# EAGLE design matrixdriver (EAGLE 7.0.0)
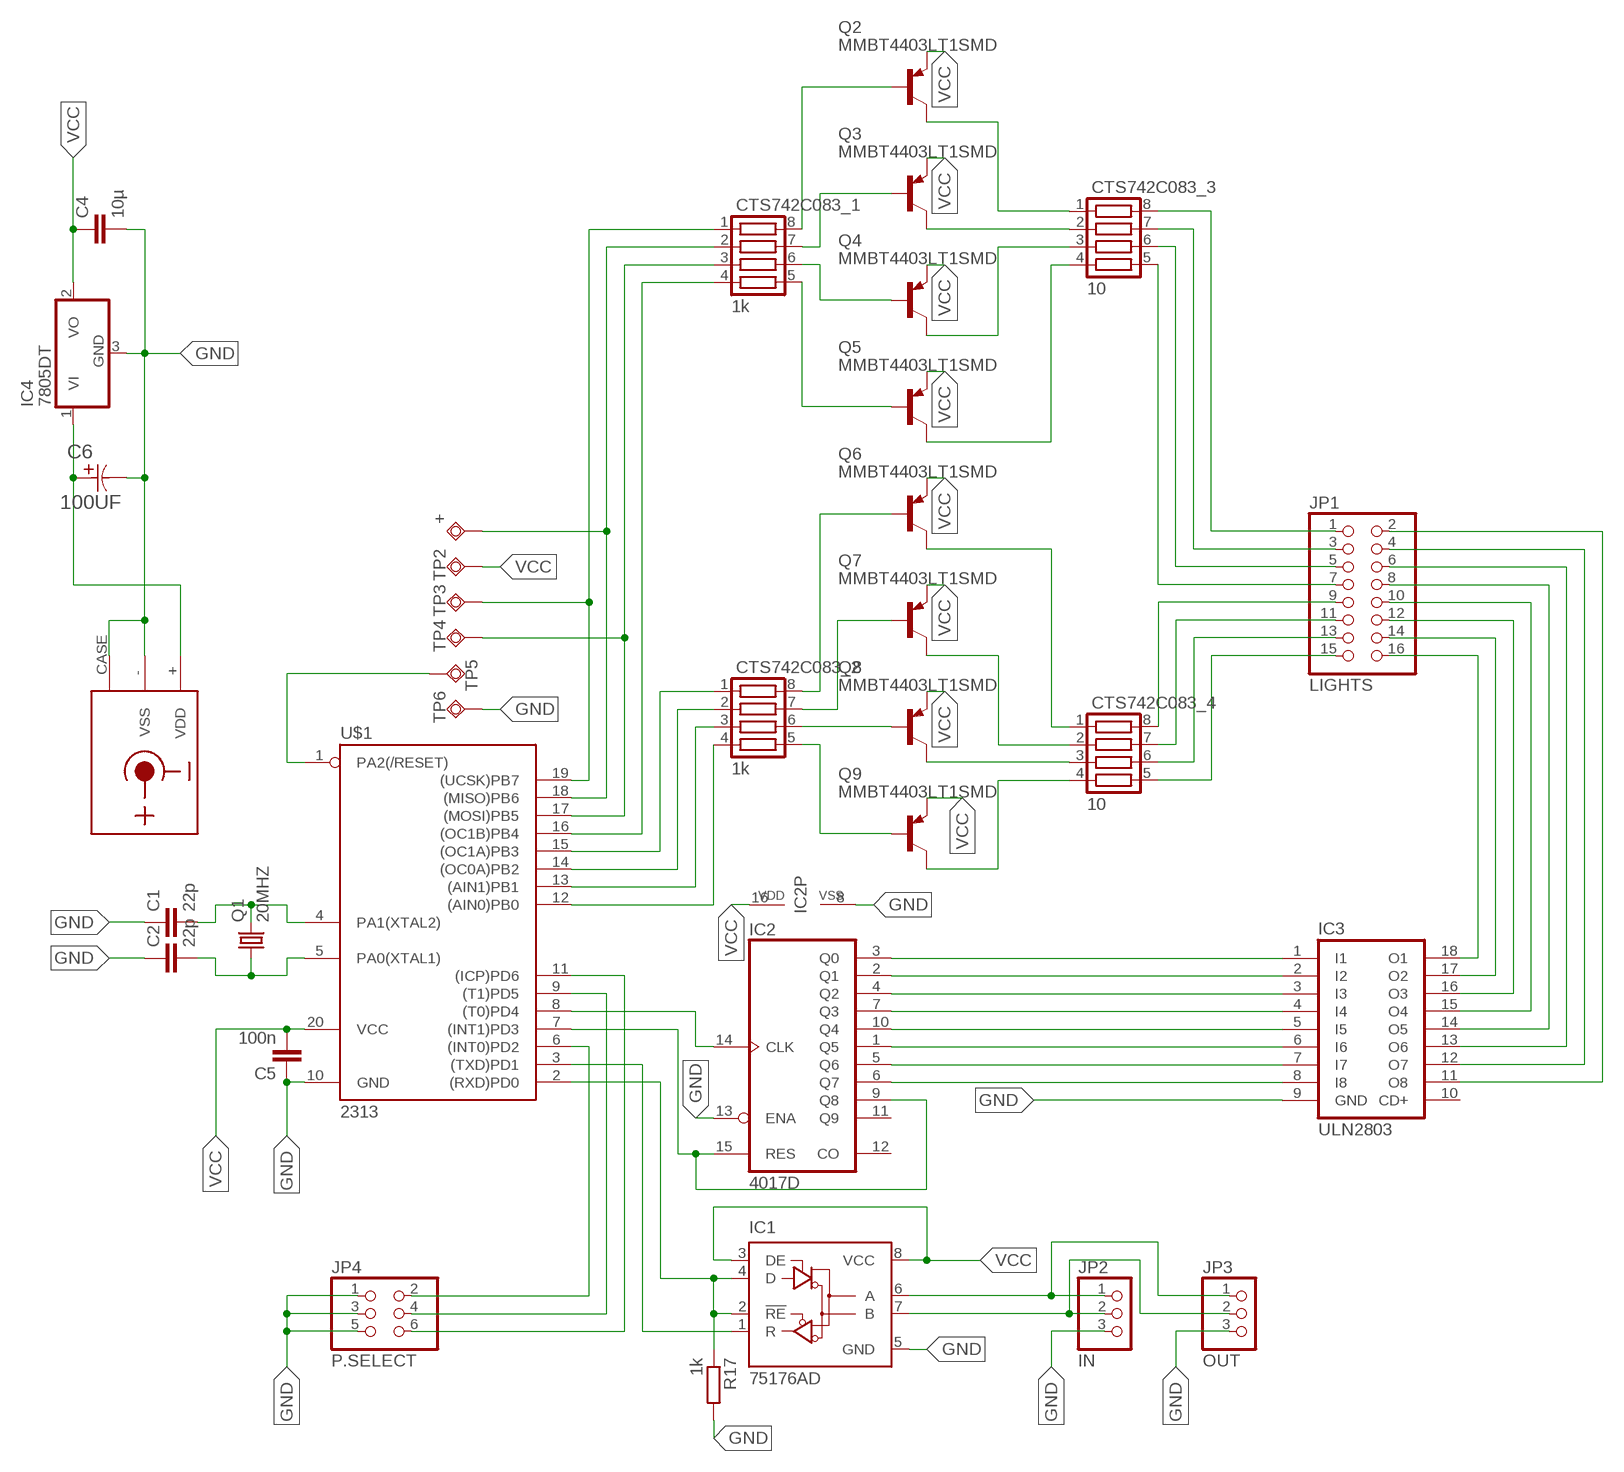
[diagram p0: schematic, sheet 1]

## Parts
+  TPSQTP20R  [TP20R]
C1  22p  C-EUC1206  [C1206]
C2  22p  C-EUC1206  [C1206]
C4  10µ  C-EUC1206  [C1206]
C5  100n  C-EUC1206  [C1206]
C6  100UF  EEE-HC1C101XP-CASE-D8  [CAPAE660X800N]
CTS742C083_1  1k  CTS742C083  [CTS742C083]
CTS742C083_2  1k  CTS742C083  [CTS742C083]
CTS742C083_3  10  CTS742C083  [CTS742C083]
CTS742C083_4  10  CTS742C083  [CTS742C083]
IC1  75176AD  [D_R-PDSO-G8]
IC2  4017D  [SO16]
IC3  ULN2803  ULN2803ASMD  [SO18W]
IC4  7805DT  [TO252]
JP1  LIGHTS  PINHD-2X8_2.54  [2X08]
JP2  IN  PINHD-1X3  [1X03]
JP3  OUT  PINHD-1X3  [1X03]
JP4  P.SELECT  PINHD-2X3  [2X03]
Q1  20MHZ  CRYSTALHC49UP  [HC49UP]
Q2  MMBT4403LT1SMD  [SOT23-BEC]
Q3  MMBT4403LT1SMD  [SOT23-BEC]
Q4  MMBT4403LT1SMD  [SOT23-BEC]
Q5  MMBT4403LT1SMD  [SOT23-BEC]
Q6  MMBT4403LT1SMD  [SOT23-BEC]
Q7  MMBT4403LT1SMD  [SOT23-BEC]
Q8  MMBT4403LT1SMD  [SOT23-BEC]
Q9  MMBT4403LT1SMD  [SOT23-BEC]
R17  1k  R-EU_R1206  [R1206]
TP2  TPSQTP19SQ  [TP19SQ]
TP3  TPSQTP20SQ  [TP20SQ]
TP4  TPSQTP20SQ  [TP20SQ]
TP5  TPSQTP20SQ  [TP20SQ]
TP6  TPSQTP20SQ  [TP20SQ]
U$1  2313  TINY2313-*S*  [SO20L$]
U$2  CUI_PJ-102A  [CUI_DCJACK_PCB]

## Nets
GND [GND]: C1.1 C2.1 C4.2 C5.1 C6.2 IC1.5(GND) IC2.8(VSS) IC2.13(ENA) IC3.9(GND) IC4.3(GND) JP2.3 JP3.3 JP4.1 JP4.3 JP4.5 R17.2 TP6.TP U$1.10(GND) U$2.-(VSS) U$2.CASE
N$1: CTS742C083_2.4 U$1.12((AIN0)PB0)
N$2: CTS742C083_2.3 U$1.13((AIN1)PB1)
N$3: CTS742C083_2.2 U$1.14((OC0A)PB2)
N$4: CTS742C083_2.1 U$1.15((OC1A)PB3)
N$5: CTS742C083_1.4 U$1.16((OC1B)PB4)
N$6: CTS742C083_1.3 TP4.TP U$1.17((MOSI)PB5)
N$7: +.TP CTS742C083_1.2 U$1.18((MISO)PB6)
N$8: CTS742C083_1.1 TP3.TP U$1.19((UCSK)PB7)
N$9: IC1.1(R) U$1.3((TXD)PD1)
N$10: IC1.2(!RE) IC1.4(D) R17.1 U$1.2((RXD)PD0)
N$11: C1.2 Q1.2 U$1.4(PA1(XTAL2))
N$12: C2.2 Q1.1 U$1.5(PA0(XTAL1))
N$13: CTS742C083_4.8 JP1.9
N$14: IC3.11(O8) JP1.2
N$15: IC2.14(CLK) U$1.8((T0)PD4)
N$16: IC2.9(Q8) IC2.15(RES) U$1.7((INT1)PD3)
N$17: IC2.3(Q0) IC3.1(I1)
N$18: IC2.2(Q1) IC3.2(I2)
N$19: IC2.4(Q2) IC3.3(I3)
N$20: IC2.7(Q3) IC3.4(I4)
N$21: IC2.10(Q4) IC3.5(I5)
N$22: IC2.1(Q5) IC3.6(I6)
N$23: IC2.5(Q6) IC3.7(I7)
N$24: IC2.6(Q7) IC3.8(I8)
N$25: IC3.18(O1) JP1.16
N$26: IC3.17(O2) JP1.14
N$27: IC3.16(O3) JP1.12
N$28: IC3.15(O4) JP1.10
N$29: CTS742C083_4.7 JP1.11
N$30: CTS742C083_4.6 JP1.13
N$31: CTS742C083_4.5 JP1.15
N$32: CTS742C083_1.7 Q3.B
N$33: CTS742C083_3.8 JP1.1
N$34: CTS742C083_3.7 JP1.3
N$35: CTS742C083_3.6 JP1.5
N$36: CTS742C083_3.5 JP1.7
N$37: CTS742C083_1.8 Q2.B
N$38: CTS742C083_1.6 Q4.B
N$39: CTS742C083_1.5 Q5.B
N$40: CTS742C083_2.6 Q8.B
N$41: CTS742C083_2.5 Q9.B
N$42: CTS742C083_2.8 Q6.B
N$43: CTS742C083_2.7 Q7.B
N$49: CTS742C083_4.4 Q9.C
N$50: CTS742C083_4.3 Q8.C
N$51: CTS742C083_4.2 Q7.C
N$52: CTS742C083_4.1 Q6.C
N$53: CTS742C083_3.4 Q5.C
N$54: CTS742C083_3.3 Q4.C
N$55: CTS742C083_3.2 Q3.C
N$56: CTS742C083_3.1 Q2.C
N$57: IC1.6(A) JP2.1 JP3.1
N$58: IC1.7(B) JP2.2 JP3.2
N$59: TP5.TP U$1.1(PA2(/RESET))
N$60: JP4.2 U$1.6((INT0)PD2)
N$61: JP4.4 U$1.9((T1)PD5)
N$62: JP4.6 U$1.11((ICP)PD6)
N$63: IC3.12(O7) JP1.4
N$64: IC3.13(O6) JP1.6
N$65: C6.1 IC4.1(VI) U$2.+(VDD)
N$66: IC3.14(O5) JP1.8
VCC: C4.1 C5.2 IC1.3(DE) IC1.8(VCC) IC2.16(VDD) IC4.2(VO) Q2.E Q3.E Q4.E Q5.E Q6.E Q7.E Q8.E Q9.E TP2.TP U$1.20(VCC)
Unconnected: IC2.11(Q9) IC2.12(CO) IC3.10(CD+)

## Library data of the parts
+ TP2-TP6 = testpad:TPSQ: Test pad
C1 C2 C5 = resistor:C-EU: CAPACITOR, European symbol
C4 = rcl:C-EU: CAPACITOR, European symbol
C6 = Panasonic-EEEFT_EEEH:EEE-: Aluminum Electrolytic Capacitors,Surface Mount Type; MPN: EEE-HC1C101XP; OC_FARNELL: 1714695; OC_NEWARK: 15R0909; PACKAGE: CASE-D8; SUPPLIER: PANASONIC; TOLERANCE: ±20 %; VOLTAGERATING: 16V
CTS742C083_1-CTS742C083_4 = resistor-net:CTS742C083: Chip Resistor Array 4 Single Resistor Source: http://www.ctscorp.com/components/Datasheets/CTSChipArrayDs.pdf
IC1 = 751xx:75176A: DIFFERENTIAL BUS TRANSCEIVER Source: http://focus.ti.com/lit/ds/symlink/sn75176a.pdf
IC2 = 40xx:4017: COUNTER/DIVIDER
IC3 = uln-udn:ULN2803A: DRIVER ARRAY
IC4 = linear:78*: Positive VOLTAGE REGULATOR Source: http://cache.national.com/ds/LM/LM78L05.pdf http://www.fairchildsemi.com/ds/LM/LM7805.pdf
JP1 = pinhead-fixdrills:PINHD-2X8: PIN HEADER
JP2 JP3 = pinhead:PINHD-1X3: PIN HEADER
JP4 = pinhead:PINHD-2X3: PIN HEADER
Q1 = crystal:CRYSTAL: CRYSTAL; OC_FARNELL: unknown; OC_NEWARK: unknown
Q2-Q9 = transistor-pnp:MMBT4403*: PNP Transistror
R17 = resistor:R-EU_: RESISTOR, European symbol
U$1 = avr-6:TINY2313*: Atmel Tiny2313 2K Flash, 128 bytes EEPROM, 128 bytes RAM
U$2 = con-dc-jack:CUI_PJ-102A

## Net classes
0 default: clearance 0.125 mm
2 GND: clearance 0.125 mm to class 0, clearance 0.125 mm to class 1, clearance 0.125 mm

## Board
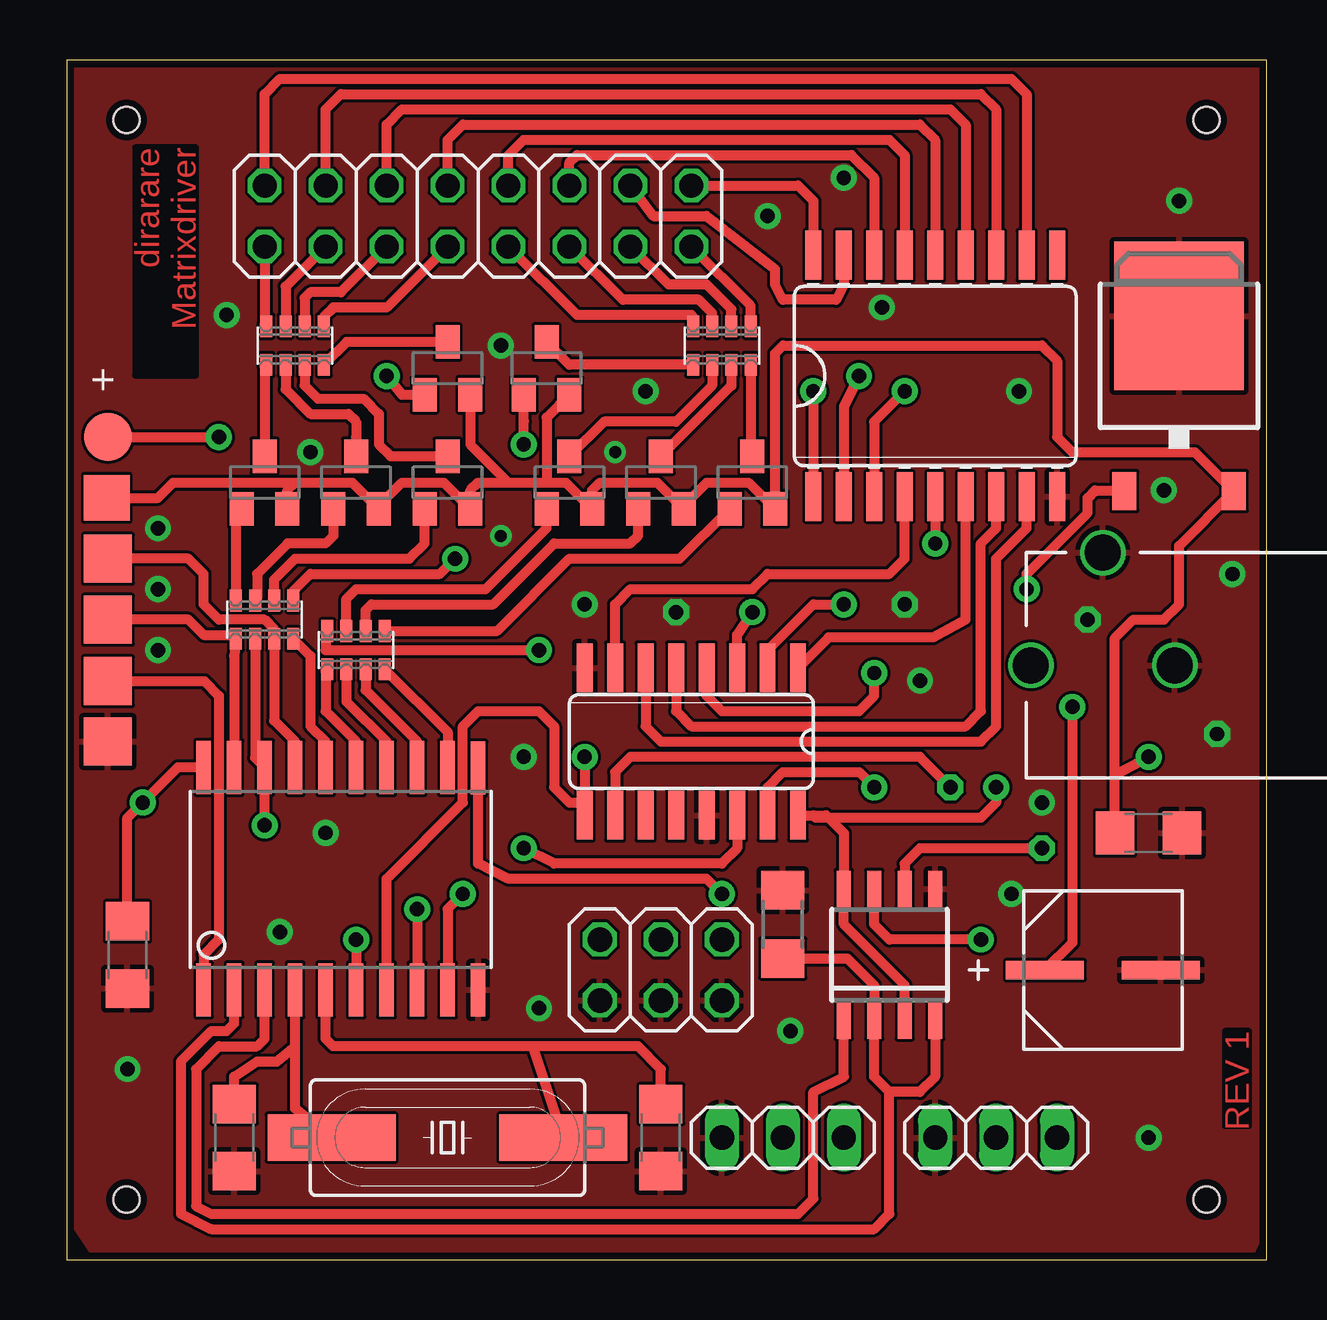
[diagram p1: board, top side]
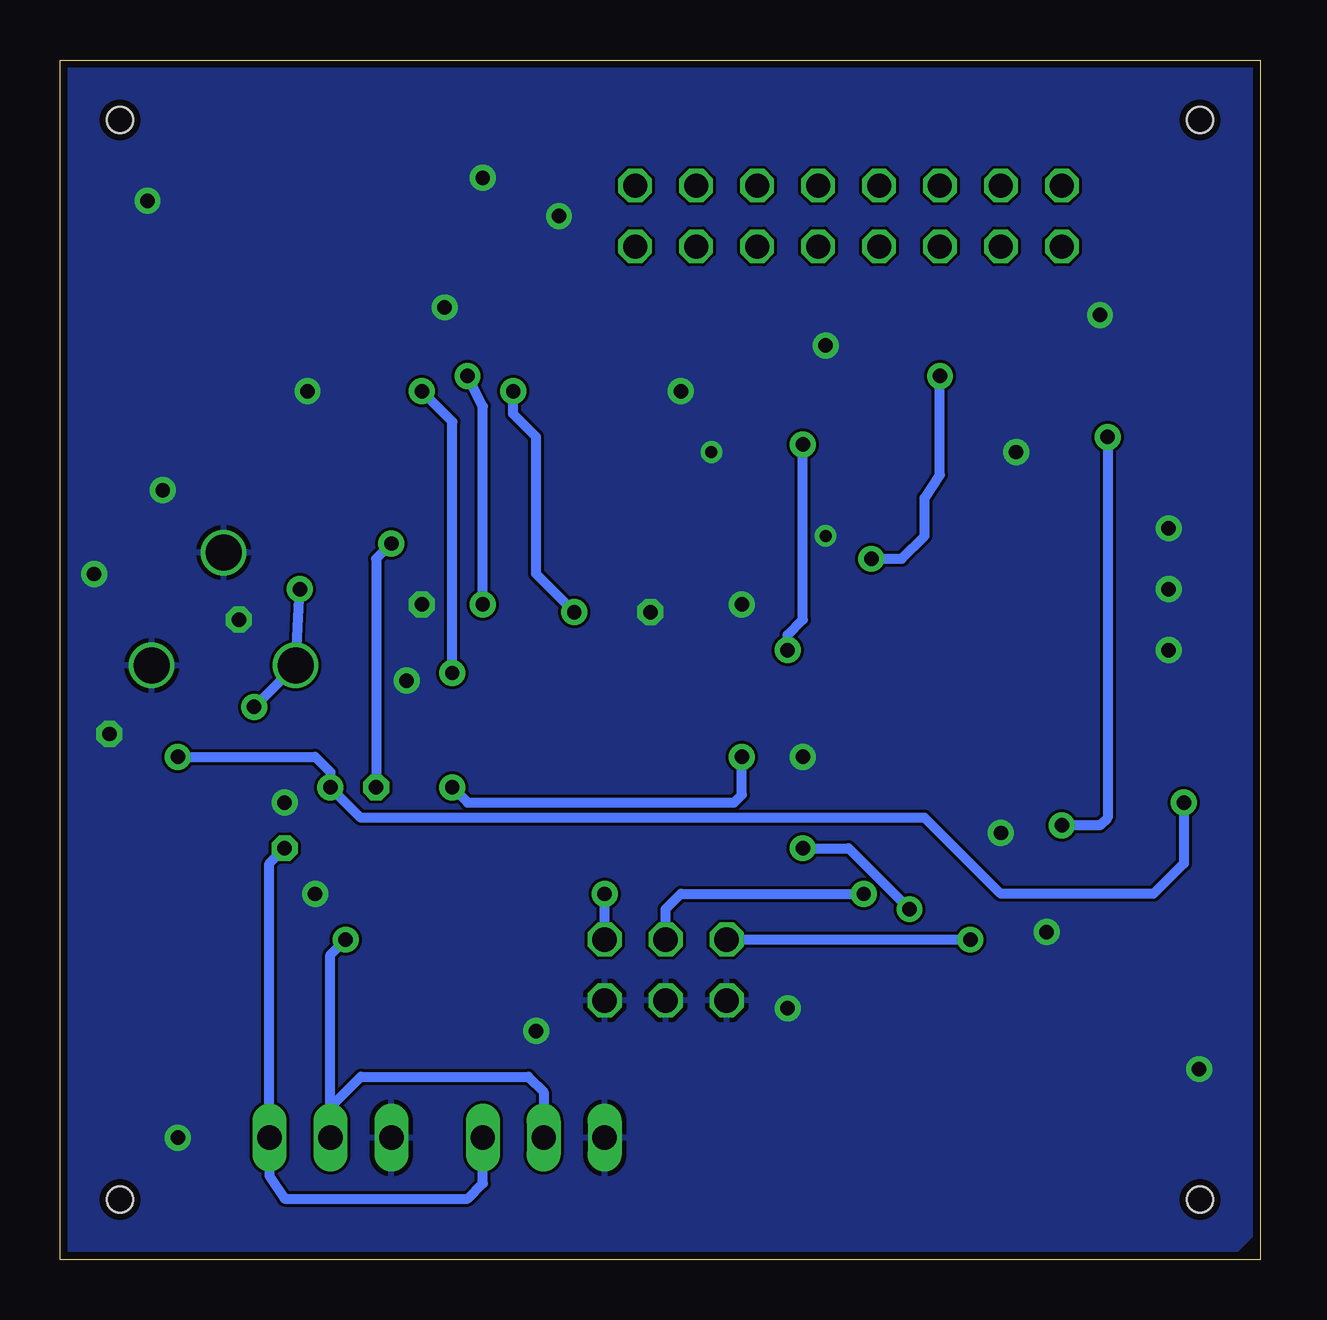
[diagram p2: board, bottom side, seen from below]

Size 50 x 50 mm. Coordinates in mm from the lower left corner, seen from the top.
Outline: 0,0 50,0 50,50 0,50 0,0
Copper layers (1*16): Top 0.035mm / dielectric 1.5mm / Bottom 0.035mm
Design rules "PCB-POOL HighSpec": minimum track width 0.125mm, minimum drill 0.2mm, track to track 0.125mm, track to pad 0.125mm, pad to pad 0.125mm, via to via 0.125mm, smd to smd 0.125mm, copper to edge 0.3mm, drill to drill 0.2mm, minimum pad ring 0.2mm, minimum via ring 0.125mm, stop-mask expansion 0.075mm, vias tented up to drill 0mil, thermal gap 0.2mm
Holes 1.1 mm at 2.5,47.5 47.5,2.5 47.5,47.5 2.5,2.5

### Footprints (pad centres in the part's own frame; a part is rotated, then mirrored left to right if it is on the bottom)
TP20R = smd 2 x 2: TP 0,0
C1206 = smd 1.6 x 1.8: 1 -1.4,0; 2 1.4,0
CAPAE660X800N = smd 3.251 x 0.762: 1 -2.413,0; 2 2.413,0
CTS742C083 = smd 0.5 x 0.9: 1 -1.2,-0.8; 2 -0.4,-0.8; 3 0.4,-0.8; 4 1.2,-0.8; 5 1.2,0.8; 6 0.4,0.8; 7 -0.4,0.8; 8 -1.2,0.8
D_R-PDSO-G8 = smd 0.6 x 1.5: 1 -1.905,-2.75; 2 -0.635,-2.75; 3 0.635,-2.75; 4 1.905,-2.75; 5 1.905,2.75; 6 0.635,2.75; 7 -0.635,2.75; 8 -1.905,2.75
SO16 = smd 0.66 x 2.032: 1 -4.445,-3.073; 2 -3.175,-3.073; 3 -1.905,-3.073; 4 -0.635,-3.073; 5 0.635,-3.073; 6 1.905,-3.073; 7 3.175,-3.073; 8 4.445,-3.073; 9 4.445,3.073; 10 3.175,3.073; 11 1.905,3.073; 12 0.635,3.073; 13 -0.635,3.073; 14 -1.905,3.073; 15 -3.175,3.073; 16 -4.445,3.073
SO18W = smd 0.66 x 2.032: 1 -5.08,-5.029; 2 -3.81,-5.029; 3 -2.54,-5.029; 4 -1.27,-5.029; 5 0,-5.029; 6 1.27,-5.029; 7 2.54,-5.029; 8 3.81,-5.029; 9 5.08,-5.029; 10 5.08,5.029; 11 3.81,5.029; 12 2.54,5.029; 13 1.27,5.029; 14 0,5.029; 15 -1.27,5.029; 16 -2.54,5.029; 17 -3.81,5.029; 18 -5.08,5.029
TO252 = smd 1 x 1.6: 1 -2.28,-4.8; 2 2.28,-4.8 | smd 5.4 x 6.2: 3 0,2.5
2X08 = drill 1 octagon: 1 -8.89,-1.27; 2 -8.89,1.27; 3 -6.35,-1.27; 4 -6.35,1.27; 5 -3.81,-1.27; 6 -3.81,1.27; 7 -1.27,-1.27; 8 -1.27,1.27; 9 1.27,-1.27; 10 1.27,1.27; 11 3.81,-1.27; 12 3.81,1.27; 13 6.35,-1.27; 14 6.35,1.27; 15 8.89,-1.27; 16 8.89,1.27
1X03 = drill 1.016 long: 1 -2.54,0; 2 0,0; 3 2.54,0
2X03 = drill 1.016 octagon: 1 -2.54,-1.27; 2 -2.54,1.27; 3 0,-1.27; 4 0,1.27; 5 2.54,-1.27; 6 2.54,1.27
HC49UP = smd 5.334 x 1.93: 1 -4.826,0; 2 4.826,0
SOT23-BEC = smd 1 x 1.4: B -0.95,-1.1; C 0,1.1; E 0.95,-1.1
R1206 = smd 1.6 x 1.803: 1 -1.422,0; 2 1.422,0
TP19SQ = smd 1.9 x 1.9: TP 0,0
TP20SQ = smd 2 x 2: TP 0,0
SO20L$ = smd 0.61 x 2.21: 1 -5.715,-4.636; 2 -4.445,-4.636; 3 -3.175,-4.636; 4 -1.905,-4.636; 5 -0.635,-4.636; 6 0.635,-4.636; 7 1.905,-4.636; 8 3.175,-4.636; 9 4.445,-4.636; 10 5.715,-4.636; 11 5.715,4.61; 12 4.445,4.636; 13 3.175,4.636; 14 1.905,4.636; 15 0.635,4.636; 16 -0.635,4.636; 17 -1.905,4.636; 18 -3.175,4.636; 19 -4.445,4.636; 20 -5.715,4.636
CUI_DCJACK_PCB = drill 1.5: + -3,0; - 3,0; CASE 0,4.7

### Placement (x,y rotation side)
+  1.73,34.29 270 top
C1  6.99,5.08 90 top
C2  24.77,5.08 90 top
C4  45.09,17.78 0 top
C5  2.54,12.7 90 top
C6  43.18,12.06 0 top
CTS742C083_1  8.26,26.67 0 top
CTS742C083_2  12.06,25.4 0 top
CTS742C083_3  9.53,38.1 0 top
CTS742C083_4  27.3,38.1 0 top
IC1  34.29,12.7 0 top
IC2  26.04,21.59 180 top
IC3  36.2,36.83 0 top
IC4  46.35,36.83 0 top
JP1  17.14,43.5 0 top
JP2  38.73,5.08 180 top
JP3  29.84,5.08 180 top
JP4  24.77,12.06 0 top
Q1  15.88,5.08 180 top
Q2  8.26,32.38 0 top
Q3  12.06,32.38 0 top
Q4  15.88,32.38 0 top
Q5  15.88,37.15 0 top
Q6  20,37.15 0 top
Q7  20.95,32.38 0 top
Q8  24.77,32.38 0 top
Q9  28.57,32.38 0 top
R17  29.84,13.97 90 top
TP2  1.68,31.75 270 top
TP3  1.73,26.67 270 top
TP4  1.73,29.21 90 top
TP5  1.72,24.1 270 top
TP6  1.73,21.59 270 top
U$1  11.43,15.88 0 top
U$2  43.18,24.77 0 top

### Tracks (layer width: path | path; a pad name or v marks a point on that pad's centre or on a via)
GND  (via drill 0.5, 0.6)
  other vias: 6.67,39.37 21.59,27.3 19.68,10.48 45.09,5.08 10.79,17.78 45.72,32.07 39.69,36.2 25.4,26.99 29.21,43.5 32.38,45.09 46.35,44.13 2.54,7.94 40.64,19.05 24.13,36.2 35.56,24.13 19.05,20.95 3.81,25.4 3.81,30.48 3.81,27.94 47.94,21.91 42.55,26.67 34.92,27.3 10.16,33.66 18.1,30.16 33.97,39.69 48.58,28.57 39.37,15.24 30.16,9.53 8.89,13.65 18.1,38.1 22.86,33.66
  pour Top (isolate 0): 49.85,49.85 0.32,49.85 0.32,1.27 0.95,0.32 49.53,0.32 49.85,0.95
  pour Bottom (isolate 0): 0.32,49.85 0.32,0.95 0.95,0.32 49.85,0.32 49.85,49.85
N$1
  Top 0.406: CTS742C083_2.4 15.88,21.99 U$1.12
N$2
  Top 0.406: CTS742C083_2.3 12.46,23.73 14.61,21.59 U$1.13
N$3
  Top 0.406: CTS742C083_2.2 11.66,23.26 13.34,21.59 U$1.14
N$4
  Top 0.406: CTS742C083_2.1 10.79,24.53 10.79,22.86 12.06,21.59 U$1.15
N$5
  Top 0.406: CTS742C083_1.4 10.16,25.16 10.16,22.23 10.79,21.59 U$1.16
N$6
  Top 0.406: TP4.TP 5.08,29.21 5.71,28.57 5.71,27.3 6.35,26.67 8.26,26.67 8.65,26.27 CTS742C083_1.3 8.65,22.46 9.53,21.59 U$1.17
N$7  (via drill 0.6)
  Top 0.406: +.TP v6.35,34.29 | v8.26,18.1 U$1.18 7.86,20.91 CTS742C083_1.2
  Bottom 0.406: v6.35,34.29 6.35,18.41 6.67,18.1 v8.26,18.1
N$8
  Top 0.406: U$1.19 6.99,25.16 CTS742C083_1.1 6.89,26.04 5.71,26.04 5.08,26.67 TP3.TP
N$9
  Top 0.406: IC1.1 32.38,7.62 31.11,6.99 31.11,2.54 30.48,1.91 6.03,1.91 5.4,2.22 5.4,7.94 6.35,8.89 7.94,8.89 8.26,9.21 U$1.3
N$10
  Top 0.406: 34.29,6.99 34.29,1.91 33.66,1.27 6.03,1.27 4.76,1.91 4.76,8.26 6.03,9.53 6.67,9.53 6.99,9.84 U$1.2 | 34.29,6.99 33.66,7.62 IC1.2 33.66,11.43 32.54,12.55 R17.1 | IC1.4 36.2,7.62 35.56,6.99 34.29,6.99
N$11
  Top 0.406: Q1.2 9.53,6.29 9.53,8.89 | 9.53,8.89 U$1.4 | C1.2 6.99,7.62 7.94,8.26 8.76,8.26 9.53,8.89
N$12
  Top 0.406: Q1.1 19.43,8.89 | 19.43,8.89 11.11,8.89 10.79,9.21 U$1.5 | 19.43,8.89 23.81,8.89 24.77,7.94 C2.2
N$13
  Top 0.406: CTS742C083_4.8 26.11,39.3 26.04,39.37 21.27,39.37 JP1.9
N$14
  Top 0.406: JP1.2 8.26,48.58 8.89,49.21 39.37,49.21 40.01,48.58 IC3.11
N$15  (via drill 0.6)
  Top 0.406: IC2.14 27.94,17.14 27.3,16.51 20.32,16.51 v19.05,17.14 | v14.61,14.61 U$1.8
  Bottom 0.406: v19.05,17.14 17.14,17.14 v14.61,14.61
N$16  (via drill 0.6)
  Top 0.406: IC2.15 29.21,19.68 29.84,20.32 33.02,20.32 v33.66,19.68 | v21.59,20.95 21.59,19.05 | 21.59,19.05 IC2.9 | U$1.7 13.34,15.88 16.51,19.05 16.51,22.23 17.14,22.86 19.68,22.86 20.32,22.23 20.32,19.68 20.95,19.05 21.59,19.05
  Bottom 0.406: v33.66,19.68 33.02,19.05 21.91,19.05 21.59,19.37 v21.59,20.95
N$17  (via drill 0.6)
  Top 0.406: IC2.3 27.94,26.04 v28.57,26.99 | v31.11,36.2 IC3.1
  Bottom 0.406: v28.57,26.99 30.16,28.57 30.16,34.29 31.11,35.24 v31.11,36.2
N$18  (via drill 0.6)
  Top 0.406: IC2.2 29.21,25.4 31.11,27.3 v32.38,27.3 | v33.02,36.83 32.38,35.56 IC3.2
  Bottom 0.406: v32.38,27.3 32.38,35.56 v33.02,36.83
N$19  (via drill 0.6)
  Top 0.406: IC2.4 26.67,23.5 27.3,22.86 33.02,22.86 33.66,23.5 v33.66,24.45 | v34.92,36.2 33.66,34.92 IC3.3
  Bottom 0.406: v33.66,24.45 33.66,34.92 v34.92,36.2
N$20
  Top 0.406: IC2.7 22.86,27.3 23.5,27.94 28.57,27.94 29.21,28.57 34.29,28.57 34.92,29.21 IC3.4
N$21  (via drill 0.6)
  Top 0.406: IC3.5 v36.2,29.84 | v36.83,19.68 35.56,20.95 23.5,20.95 22.86,20.32 IC2.10
  Bottom 0.406: v36.2,29.84 36.83,29.21 v36.83,19.68
N$22
  Top 0.406: IC3.6 37.47,26.67 36.09,25.93 31.75,25.93 IC2.1
N$23
  Top 0.406: IC2.5 25.4,22.86 26.04,22.23 37.47,22.23 38.1,22.86 38.1,29.84 38.73,30.48 IC3.7
N$24
  Top 0.406: IC2.6 24.13,22.23 24.77,21.59 38.1,21.59 38.73,22.23 38.73,29.21 40.01,30.48 IC3.8
N$25
  Top 0.406: JP1.16 30.48,44.77 31.11,44.13 IC3.18
N$26
  Top 0.406: JP1.14 24.45,43.5 26.67,43.5 29.53,41.27 29.53,40.64 29.84,40.01 32.07,40.01 32.38,40.64 IC3.17
N$27
  Top 0.406: JP1.12 20.95,45.72 21.27,46.04 32.7,46.04 33.66,45.09 IC3.16
N$28
  Top 0.406: JP1.10 18.41,46.04 19.05,46.67 34.29,46.67 34.92,46.04 IC3.15
N$29
  Top 0.406: CTS742C083_4.7 26.91,39.45 26.35,40.01 23.18,40.01 JP1.11
N$30
  Top 0.406: CTS742C083_4.6 27.7,39.6 26.67,40.64 25.08,40.64 JP1.13
N$31
  Top 0.406: CTS742C083_4.5 28.5,39.76 JP1.15
N$32
  Top 0.406: Q3.B 11.12,30.16 10.79,29.84 9.21,29.84 7.94,28.57 7.94,27.55 CTS742C083_1.7
N$33
  Top 0.406: JP1.1 8.26,38.97 CTS742C083_3.8
N$34
  Top 0.406: JP1.3 9.12,40.56 CTS742C083_3.7
N$35
  Top 0.406: JP1.5 11.43,40.32 10.16,40.32 9.93,40.09 CTS742C083_3.6
N$36
  Top 0.406: JP1.7 13.34,39.69 11.11,39.69 10.72,39.3 CTS742C083_3.5
N$37
  Top 0.406: Q2.B 7.05,31.04 CTS742C083_1.8
N$38
  Top 0.406: CTS742C083_1.6 8.65,28.34 9.53,29.21 14.29,29.21 14.92,29.84 Q4.B
N$39  (via drill 0.6)
  Top 0.406: CTS742C083_1.5 9.46,27.87 10.16,28.57 15.56,28.57 v16.19,29.21 | v13.34,36.83 13.97,36.05 Q5.B
  Bottom 0.406: v16.19,29.21 14.92,29.21 13.97,30.16 13.97,31.75 13.34,32.7 v13.34,36.83
N$40
  Top 0.406: CTS742C083_2.6 12.46,27.07 12.7,27.3 17.78,27.3 20.32,29.84 23.5,29.84 23.81,30.16 Q8.B
N$41
  Top 0.406: CTS742C083_2.5 17.95,26.2 20.95,29.21 25.55,29.21 Q9.B
N$42  (via drill 0.6)
  Top 0.406: CTS742C083_2.8 10.79,26.13 10.79,25.4 v19.68,25.4 | v19.05,33.97 19.05,34.93 Q6.B
  Bottom 0.406: v19.68,25.4 19.68,26.04 19.05,26.67 v19.05,33.97
N$43
  Top 0.406: CTS742C083_2.7 11.66,27.54 12.06,27.94 17.46,27.94 20,30.48 Q7.B 19.84,31.11
N$49
  Top 0.406: CTS742C083_4.4 28.5,33.55 Q9.C
N$50
  Top 0.406: CTS742C083_4.3 27.7,36.42 Q8.C
N$51
  Top 0.406: CTS742C083_4.2 26.91,36.43 25.4,34.92 22.39,34.92 Q7.C
N$52
  Top 0.406: CTS742C083_4.1 20.95,37.3 Q6.C
N$53
  Top 0.406: Q5.C 11.67,38.25 CTS742C083_3.4
N$54
  Top 0.406: CTS742C083_3.3 9.93,36.43 10.48,35.88 12.38,35.88 13.02,35.24 13.02,33.97 13.51,33.48 Q4.C
N$55
  Top 0.406: CTS742C083_3.2 9.12,36.28 10.16,35.24 11.75,35.24 12.06,34.92 12.06,34.29 Q3.C
N$56
  Top 0.406: CTS742C083_3.1 8.26,37.23 Q2.C
N$57  (via drill 0.6)
  Top 0.406: v40.64,17.14 35.56,17.14 34.92,16.51 IC1.6
  Bottom 0.406: v40.64,17.14 41.27,16.51 JP2.1 41.27,3.49 40.64,2.54 33.02,2.54 32.38,3.17 JP3.1
N$58  (via drill 0.6)
  Top 0.406: v38.1,13.34 34.29,13.34 33.66,13.97 IC1.7
  Bottom 0.406: v38.1,13.34 38.73,12.7 JP2.2 38.73,6.35 37.47,7.62 30.48,7.62 29.84,6.99 JP3.2
N$59
  Top 0.406: TP5.TP 5.74,24.11 6.35,23.5 6.35,13.34 5.71,12.7 U$1.1
N$60  (via drill 0.6)
  Top 0.406: v12.06,13.34 U$1.6
  Bottom 0.406: JP4.2 v12.06,13.34
N$61  (via drill 0.6)
  Top 0.406: v16.51,15.24 15.88,14.61 U$1.9
  Bottom 0.406: JP4.4 24.77,14.61 24.13,15.24 v16.51,15.24
N$62  (via drill 0.6)
  Top 0.406: v27.3,15.24 26.67,15.88 18.41,15.88 17.14,16.51 U$1.11
  Bottom 0.406: JP4.6 v27.3,15.24
N$63
  Top 0.406: JP1.4 10.79,47.94 11.43,48.58 38.1,48.58 38.73,47.94 IC3.12
N$64
  Top 0.406: JP1.6 13.34,47.31 13.97,47.94 36.83,47.94 37.47,47.31 IC3.13
N$65  (via drill 0.6)
  Top 0.406: v41.91,23.04 41.91,13.21 C6.1 | v40.01,27.94 40.01,28.57 42.55,31.11 42.55,31.75 42.86,32.07 42.9,32.03 IC4.1
  Bottom 0.406: v40.01,27.94 U$2.+ v41.91,23.04
N$66
  Top 0.406: JP1.8 15.88,46.67 16.51,47.31 35.56,47.31 36.2,46.67 IC3.14
VCC  (via drill 0.6)
  Top 0.406: Q2.E 9.21,32.06 9.53,32.38 | 9.53,32.38 11.91,32.38 Q3.E 13.02,31.43 13.97,32.38 15.72,32.38 Q4.E 16.82,32.06 17.14,32.38 18.41,32.38 | 18.41,32.38 20,32.38 | 20,32.38 20.8,32.38 Q7.E 21.91,32.06 22.23,32.38 24.61,32.38 Q8.E 25.71,31.43 26.67,32.38 28.43,32.38 Q9.E 29.52,37.78 29.84,38.1 40.64,38.1 41.27,37.47 41.27,34.29 41.91,33.66 47.01,33.66 IC4.2 46.35,29.75 46.35,27.3 45.72,26.67 44.45,26.67 43.69,25.91 43.69,20.19 | Q5.E 16.82,33.98 18.41,32.38 | IC1.3 34.92,11.43 32.38,13.97 IC1.8 32.38,17.78 31.65,18.52 31.11,18.52 | IC2.16 31.11,18.52 | C4.1 43.69,20.19 | 43.69,20.19 v45.09,20.95 | v38.73,19.68 38.73,19.05 38.1,18.41 31.22,18.41 31.11,18.52 | TP2.TP 3.81,31.75 4.45,32.38 9.53,32.38 | U$1.20 4.64,20.51 v3.17,19.05 2.54,18.41 C5.2 | Q6.E 20,35.1 20,32.38
  Bottom 0.406: v45.09,20.95 39.37,20.95 38.73,20.32 v38.73,19.68 37.47,18.41 13.97,18.41 10.79,15.24 4.45,15.24 3.17,16.51 v3.17,19.05

### Text on the board
Top: dirarare / Matrixdriver | REV 1